# EAGLE schematic Z_Probing_Add_on_Board (EAGLE 7.2.0)
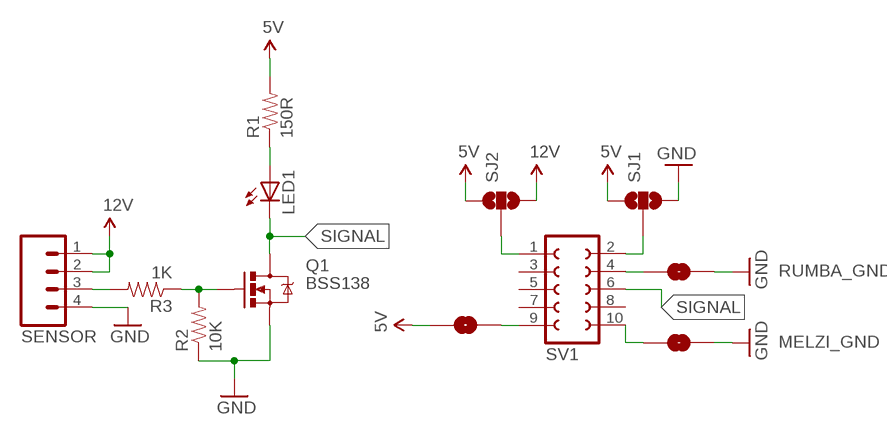
[diagram p0: schematic, sheet 1]

## Parts
LED1  LEDCHIPLED_0805  [CHIPLED_0805]
MELZI_GND  SOLDERJUMPERNO  [SJ_2S-NO]
MELZI_GND1  SOLDERJUMPERNO  [SJ_2S-NO]
Q1  BSS138  MOSFET-NCHANNELBSS123LT1G  [SOT23]
R1  150R  0.3OHM-1/8W-1%(0805)  [0805]
R2  10K  0.3OHM-1/8W-1%(0805)  [0805]
R3  1K  0.3OHM-1/8W-1%(0805)  [0805]
RUMBA_GND  SOLDERJUMPERNO  [SJ_2S-NO]
SENSOR  M04PTH  [1X04]
SJ1  SOLDERJUMPER_2WAYS  [SJ_3]
SJ2  SOLDERJUMPER_2WAYS  [SJ_3]
SV1  FE05-2  [FE05-2]

## Nets
2.8V: SENSOR.1 SENSOR.2 SJ2.3 ; supply symbol labelled 12V
5V: MELZI_GND1.1 R1.2 SJ1.1 SJ2.1
GND: MELZI_GND.2 Q1.2(S) R2.1 RUMBA_GND.2 SENSOR.4 SJ1.3
N$1: RUMBA_GND.1 SV1.4
N$2: MELZI_GND.1 SV1.10
N$3: SJ1.2 SV1.2
N$4: R3.2 SENSOR.3
N$5: SJ2.2 SV1.1
N$6: Q1.1(G) R2.2 R3.1
N$7: MELZI_GND1.2 SV1.9
N$8: SV1.6
N$10: LED1.A R1.1
SIGNAL: LED1.C Q1.3(D)
Unconnected: SV1.3 SV1.5 SV1.7 SV1.8

## Library data of the parts
LED1 = adafruit:LED: LED OSRAM: - CHIPLED LG R971, LG N971, LY N971, LG Q971, LY Q971, LO R971, LY R971 LH N974, LH R974 LS Q976, LO Q976, LY Q976 LO Q996 - Hyper CHIPLED LW Q18S LB Q993, LB Q99A, LB R99A - SideLED LS A670, LO A670, LY A670, LG A670, LP A670 LB A673, LV A673, LT A673, LW A673 LH A674 LY A675 LS A676, LA A676, LO A676, LY A676, LW A676 LS A679, LY A679, LG A679 - Hyper Micro SIDELED® LS Y876, LA Y876, LO Y876, LY Y876 LT Y87S - SmartLED LW L88C, LW L88S LB L89C, LB L89S, LG L890 LS L89K, LO L89K, LY L89K LS L896, LA L896, LO L896, LY L896 - TOPLED LS T670, LO T670, LY T670, LG T670, LP T670 LSG T670, LSP T670, LSY T670, LOP T670, LYG T670 LG T671, LOG T671, LSG T671 LB T673, LV T673, LT T673, LW T673 LH T674 LS T676, LA T676, LO T676, LY T676, LB T676, LH T676, LSB T676, LW T676 LB T67C, LV T67C, LT T67C, LS T67K, LO T67K, LY T67K, LW E67C LS E67B, LA E67B, LO E67B, LY E67B, LB E67C, LV E67C, LT E67C LW T67C LS T679, LY T679, LG T679 LS T770, LO T770, LY T770, LG T770, LP T770 LB T773, LV T773, LT T773, LW T773 LH T774 LS E675, LA E675, LY E675, LS T675 LS T776, LA T776, LO T776, LY T776, LB T776 LHGB T686 LT T68C, LB T68C - Hyper Mini TOPLED® LB M676 - Mini TOPLED Santana® LG M470 LS M47K, LO M47K, LY M47K Source: http://www.osram.convergy.de/
MELZI_GND MELZI_GND1 RUMBA_GND = SparkFun-Passives:SOLDERJUMPER: Solder Jumper Standard SMD solder jumper. Used to automate production. Two varients : Normally Open and Normally Closed are the same, but have different paste layers. NC will have a large amount of paste and should jumper during reflow.
Q1 = SparkFun-DiscreteSemi:MOSFET-NCHANNEL: Common NMOSFET Parts MFG P/N Store ID Prod ID FDD8780 TRANS-09984 SI7820DN TRANS-11055 FDS6630A IC-08089 2N7002PW TRANS-11151 FQP30N06L COM-10213 TRANS-10060 BSS123LT1G TRANS-08345 BSS138 TRANS-00830 BS170 2N7000; PROD_ID: TRANS-08345
R1-R3 = SparkFun-Resistors:0.3OHM-1/8W-1%(0805); PROD_ID: RES-11622; VALUE: 0.3
SENSOR = SparkFun-Connectors:M04: Header 4 Standard 4-pin 0.1" header. Use with straight break away headers (SKU : PRT-00116), right angle break away headers (PRT-00553), swiss pins (PRT-00743), machine pins (PRT-00117), and female headers (PRT-00115). Molex polarized connector foot print use with SKU : PRT-08231 with associated crimp pins and housings. 1MM SMD Version SKU: PRT-10208
SJ1 SJ2 = SparkFun-Passives:SOLDERJUMPER_2WAY: Solder Jumper 2 way solder jumper
SV1 = con-lsta:FE05-2: FEMALE HEADER; OC_FARNELL: unknown; OC_NEWARK: unknown